# Altium schematic sheet CAN.SchDoc
size A4; SheetNumber: 9; SheetTotal: 10
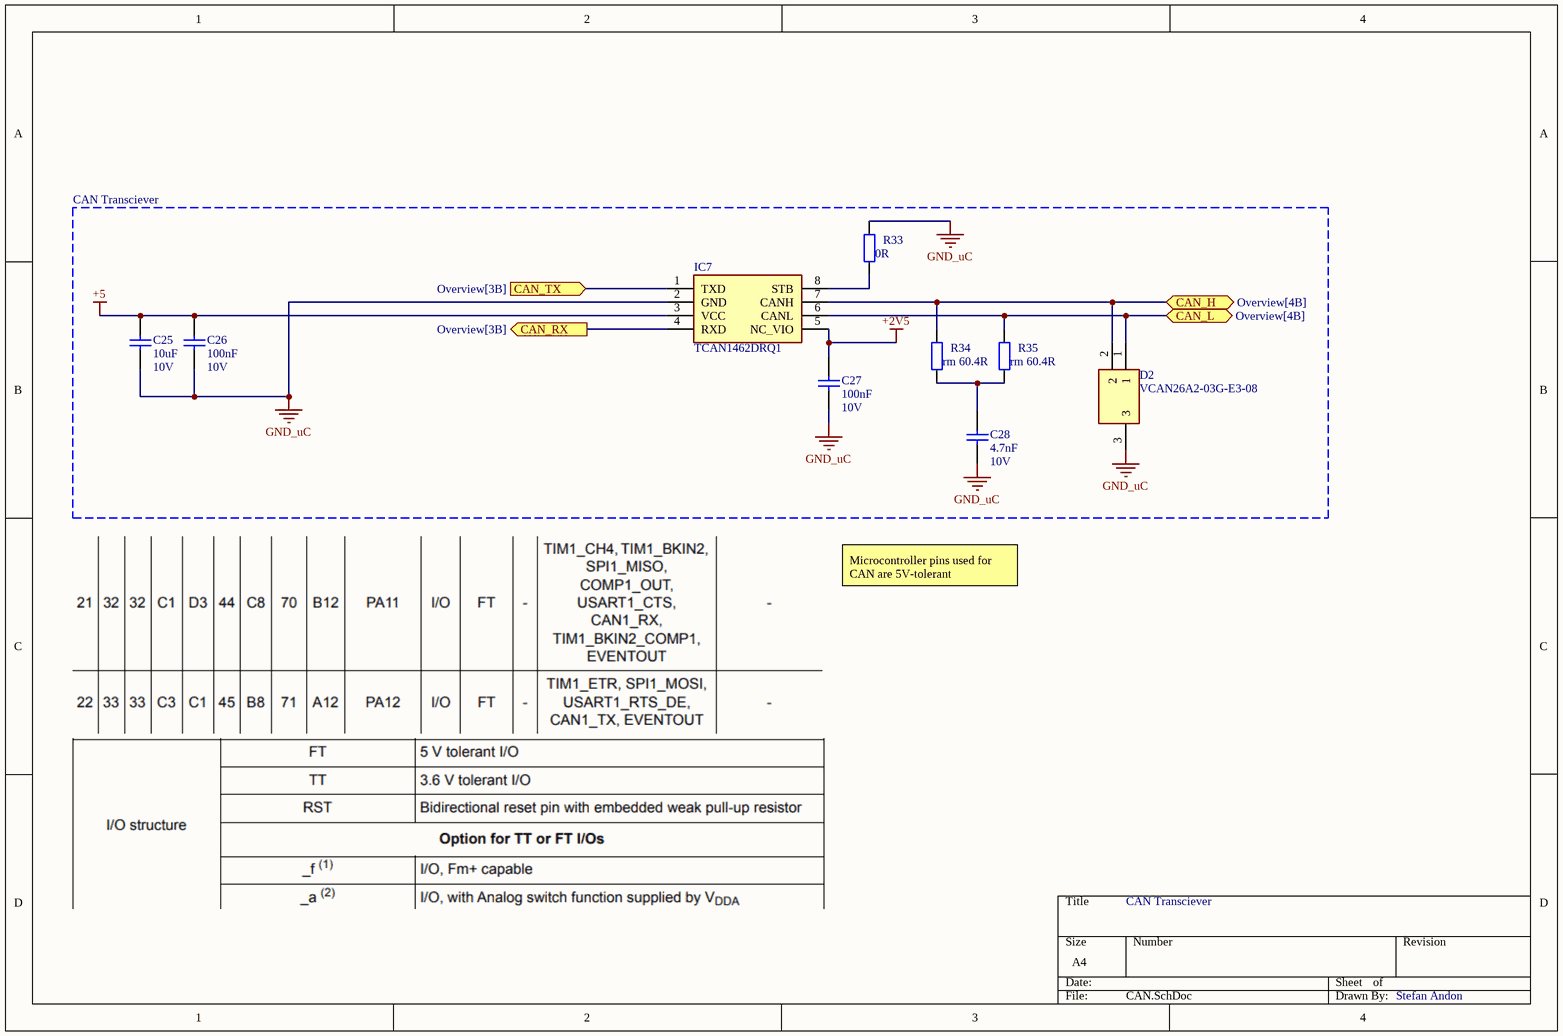
[diagram p0: CAN.SchDoc]

## Parts
C25  value 10uF  Voltage: 10V  [CAP_0603]  (hidden comment: Capacitor_SMD)
C26  value 100nF  Voltage: 10V  [CAP_0603]  (hidden comment: Capacitor_SMD)
C27  value 100nF  Voltage: 10V  [CAP_0603]  (hidden comment: Capacitor_SMD)
C28  value 4.7nF  Voltage: 10V  [CAP_0603]  (hidden comment: Capacitor_SMD)
D2  VCAN26A2-03G-E3-08  [SOT65P230X110-3N]
IC7  TCAN1462DRQ1  [SOIC127P600X175-8N]
R33  value 0R  [RES_0603]  (hidden comment: Resistor_SMD)
R34  value rm 60.4R  [RES_0603]  (hidden comment: Resistor_SMD)
R35  value rm 60.4R  [RES_0603]  (hidden comment: Resistor_SMD)

## Blocks framed on the sheet
CAN Transciever: C25-C28 D2 IC7 R33-R35

## Ports
CAN_H (bidir, see Overview[4B]), CAN_L (bidir, see Overview[4B]), CAN_RX (out, see Overview[3B]), CAN_TX (in, see Overview[3B])

## Nets
+2V5: C27.1 IC7.5(NC_VIO)
+5: C25.1 C26.1 IC7.3(VCC)
GND_uC: C25.2 C26.2 C27.2 C28.2 D2.3 IC7.2(GND) R33.1
CAN_H: D2.2 IC7.7(CANH) R34.1 ; port CAN_H
CAN_L: D2.1 IC7.6(CANL) R35.1 ; port CAN_L
CAN_RX: IC7.4(RXD) ; port CAN_RX
CAN_TX: IC7.1(TXD) ; port CAN_TX
NetC28_1: C28.1 R34.2 R35.2
NetIC7_8: IC7.8(STB) R33.2

## Notes on the sheet
- Microcontroller pins used for CAN are 5V-tolerant
- CAN Transciever
- Stefan Andon

## Library data of the parts
C25 = CMP-001-0004-13: SMD Capacitor; Tolerance: tbd; BOM: 10uF, 10V, tbd, tbd,CAP_0603; Dielectric: tbd; Package: tbd
C26 C27 = CMP-001-0004-13: SMD Capacitor; Tolerance: tbd; BOM: 100nF, 10V, tbd, tbd,CAP_0603; Dielectric: tbd; Package: tbd
C28 = CMP-001-0004-13: SMD Capacitor; Tolerance: tbd; BOM: 4.7nF, 10V, tbd, tbd,CAP_0603; Dielectric: tbd; Package: tbd
D2 = VCAN26A2-03G-E3-08: TVS Diode (Bi-directional); Manufacturer_Name: Vishay; Datasheet Link: https://www.vishay.com/docs/85894/vcan26a2-03g.pdf; Height: 1.1mm; Manufacturer_Part_Number: VCAN26A2-03G-E3-08; Mouser Part Number: 78-VCAN26A2-03G-E308; Mouser Price/Stock: https://www.mouser.co.uk/ProductDetail/Vishay-General-Semiconductor/VCAN26A2-03G-E3-08?qs=53vSufdqhLqU7%252BocFt%252Bylg%3D%3D; Arrow Part Number: VCAN26A2-03G-E3-08; Arrow Price/Stock: https://www.arrow.com/en/products/vcan26a2-03g-e3-08/vishay?utm_currency=USD&region=nac
IC7 = TCAN1462DRQ1: Integrated Circuit; Manufacturer_Name: Texas Instruments; Datasheet Link: https://www.ti.com/lit/ds/symlink/tcan1462v-q1.pdf?ts=1700901504635; Height: 1.75mm; Manufacturer_Part_Number: TCAN1462DRQ1; Mouser Part Number: 595-TCAN1462DRQ1; Mouser Price/Stock: https://www.mouser.co.uk/ProductDetail/Texas-Instruments/TCAN1462DRQ1?qs=Jm2GQyTW%2Fbh7aeYIcsA55A%3D%3D; Arrow Part Number: TCAN1462DRQ1; Arrow Price/Stock: https://www.arrow.com/en/products/tcan1462drq1/texas-instruments?region=nac
R33-R35 = CMP-001-0003-18: Tolerance: tbd; Power: 7W; BOM: Value+', '+Power+', '+Tolerance+', '+CurrentFootprint; Package: tbd